# EAGLE design SolarCellY_v2_6milmag (EAGLE 9.3.1)
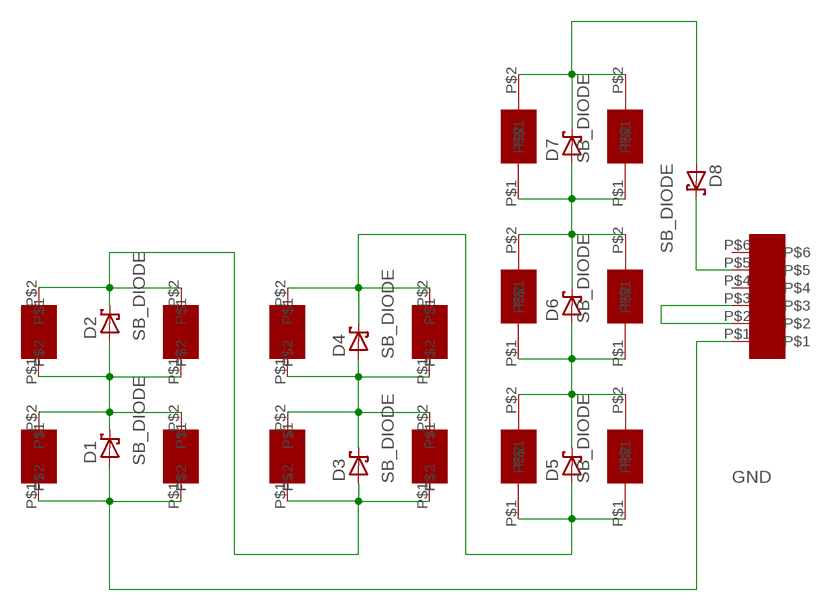
[diagram p0: schematic, sheet 1]

## Parts
11  SLMD121H04L  [SLMD121H04L]
12  SLMD121H04L  [SLMD121H04L]
13  SLMD121H04L  [SLMD121H04L]
14  SLMD121H04L  [SLMD121H04L]
21  SLMD121H04L  [SLMD121H04L]
22  SLMD121H04L  [SLMD121H04L]
23  SLMD121H04L  [SLMD121H04L]
24  SLMD121H04L  [SLMD121H04L]
D1  SB_DIODE  [SB_DIODE]
D2  SB_DIODE  [SB_DIODE]
D3  SB_DIODE  [SB_DIODE]
D4  SB_DIODE  [SB_DIODE]
D5  SB_DIODE  [SB_DIODE]
D6  SB_DIODE  [SB_DIODE]
D7  SB_DIODE  [SB_DIODE]
D8  SB_DIODE  [SB_DIODE]
U$1  M20-8760342  [M20-8760342]
U$2  KXOB22-04X3F  [KXOB22-04X3F]
U$3  KXOB22-04X3F  [KXOB22-04X3F]
U$4  KXOB22-04X3F  [KXOB22-04X3F]
U$5  KXOB22-04X3F  [KXOB22-04X3F]
U$6  KXOB22-04X3F  [KXOB22-04X3F]
U$7  KXOB22-04X3F  [KXOB22-04X3F]

## Nets
GND: 11.P$1 12.P$1 D1.POS U$1.P$1
N$1: U$1.P$2 U$1.P$3
N$2: 11.P$2 12.P$2 13.P$1 14.P$1 D1.NEG D2.POS
N$3: 13.P$2 14.P$2 21.P$1 22.P$1 D2.NEG D3.POS
N$4: 23.P$2 24.P$2 D4.NEG D5.POS U$2.P$1 U$3.P$1
N$5: 21.P$2 22.P$2 23.P$1 24.P$1 D3.NEG D4.POS
N$6: D5.NEG D6.POS U$2.P$2 U$3.P$2 U$4.P$1 U$5.P$1
N$8: D6.NEG D7.POS U$4.P$2 U$5.P$2 U$6.P$1 U$7.P$1
N$10: D7.NEG D8.POS U$6.P$2 U$7.P$2
N$14: D8.NEG U$1.P$5
Unconnected: U$1.P$4 U$1.P$6

## Library data of the parts
11-14 21-24 = Solar:SLMD121H04L; HEIGHT: 2
D1-D8 = Solar:SB_DIODE
U$1 = Solar:M20-8760342; HEIGHT: 8.64
U$2-U$7 = Solar:KXOB22-04X3F; HEIGHT: 1.8

## Net classes
1 power: width 0.254 mm

## Board
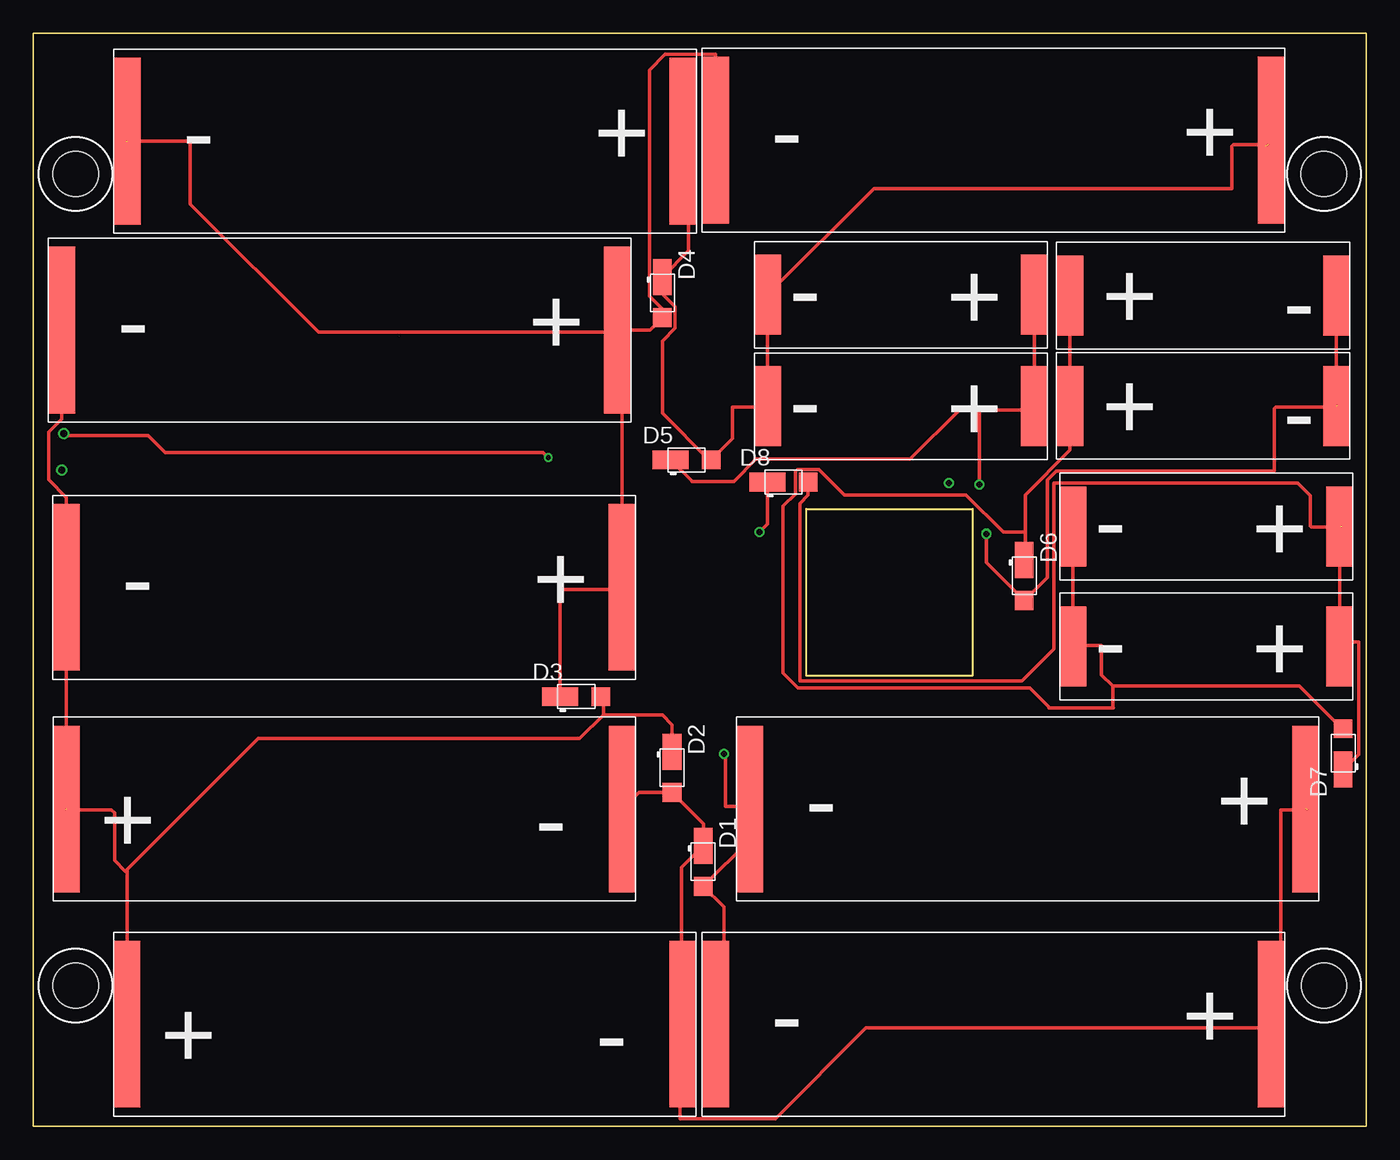
[diagram p1: board, top side]
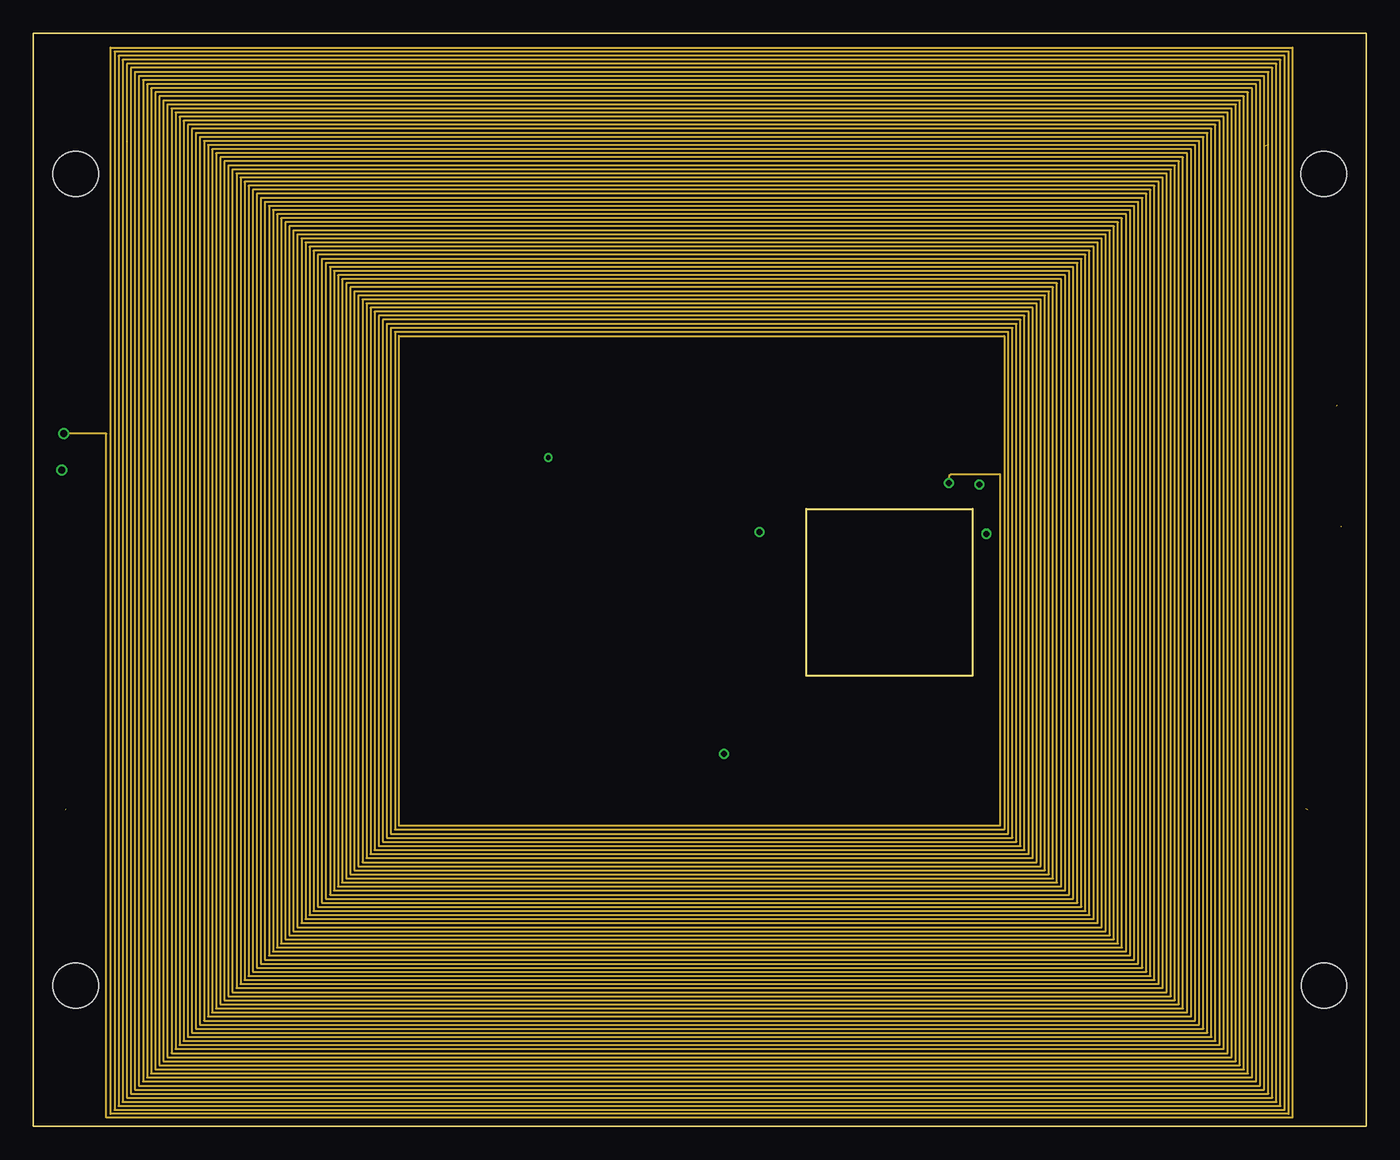
[diagram p2: board, inner layer Route2]
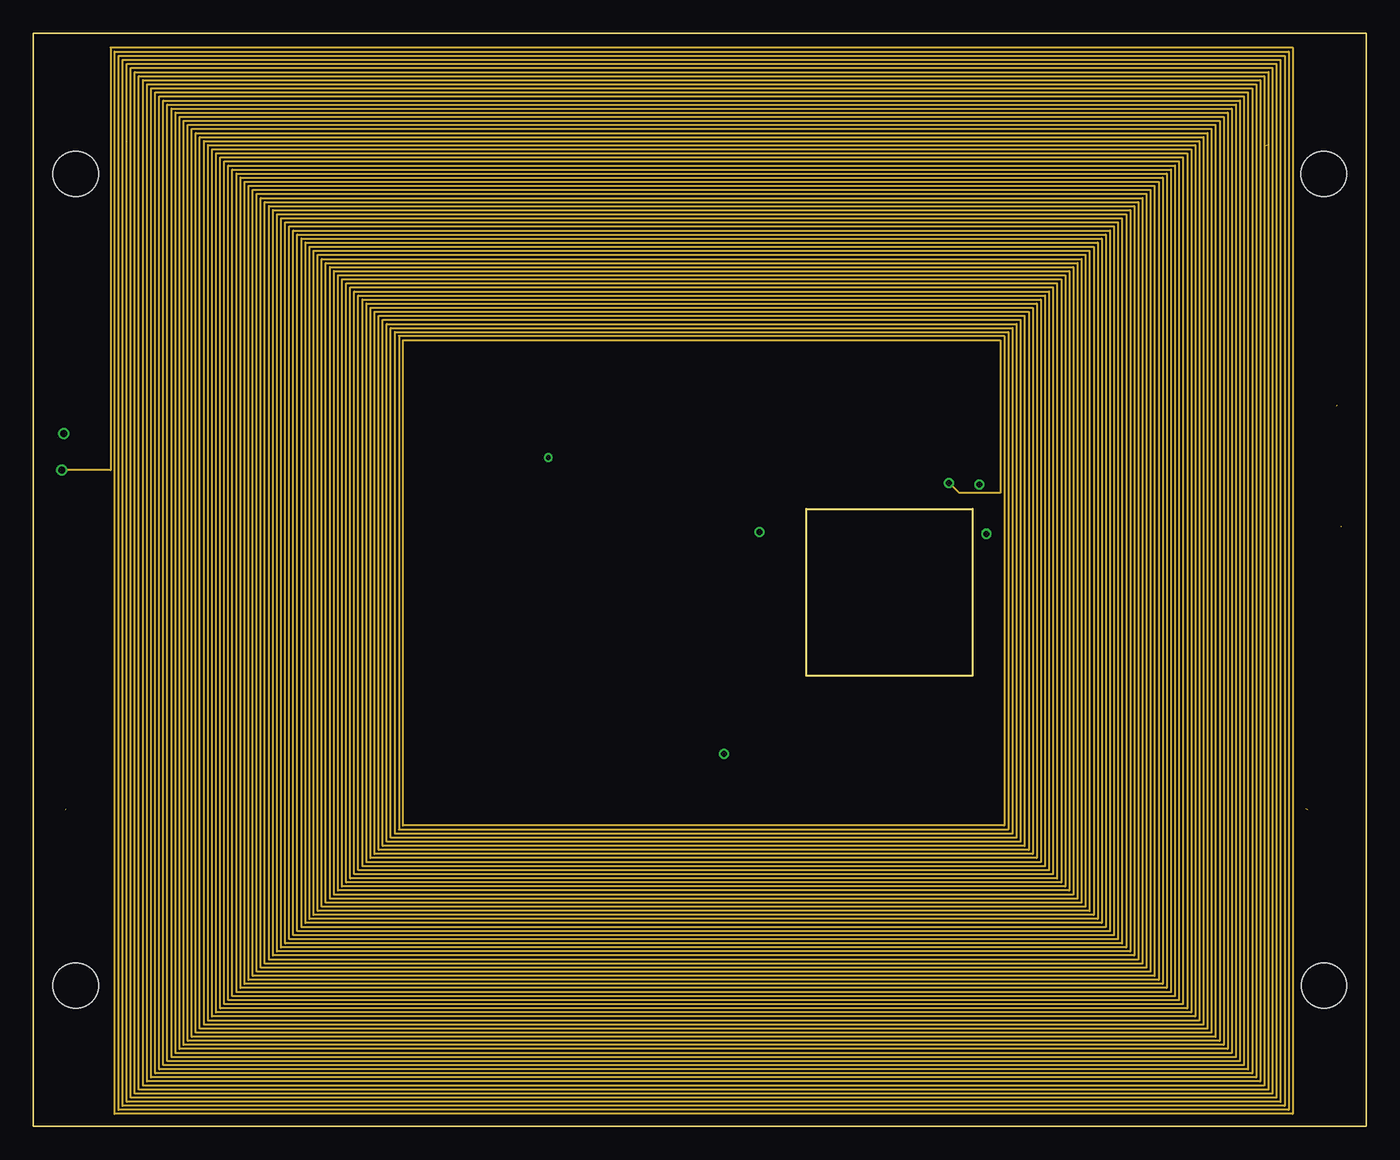
[diagram p3: board, inner layer Route15]
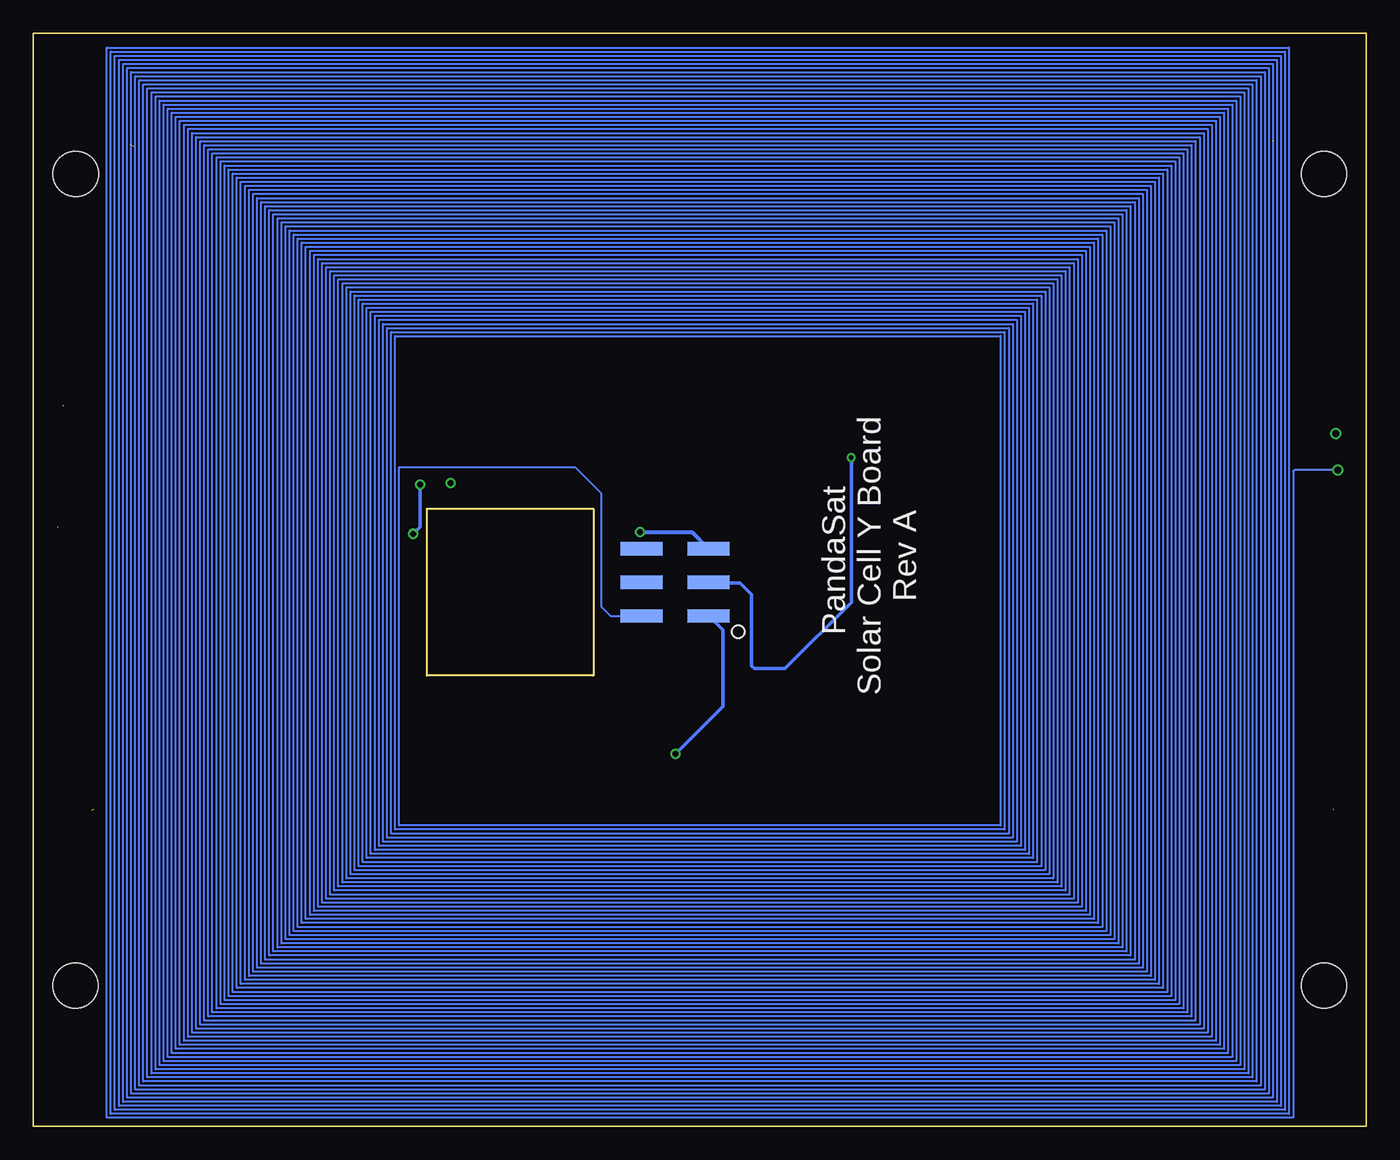
[diagram p4: board, bottom side, seen from below]

Size 100 x 82 mm. Coordinates in mm from the lower left corner, seen from the top.
Outline: 0,0 0,82 100,82 100,0 0,0
Copper layers (1*2*15*16): Top 0.035559375mm / dielectric 0.17018125mm / Route2 0.01778125mm / dielectric 47mil / Route15 0.01778125mm / dielectric 0.17018125mm / Bottom 0.035559375mm
Design rules "oshpark-4layer *": minimum track width 5mil, minimum drill 10mil, track to track 5mil, track to pad 5mil, pad to pad 5mil, via to via 5mil, smd to smd 5mil, copper to edge 15mil, drill to drill 6mil, minimum pad ring 4mil, minimum via ring 6mil, stop-mask expansion 2.5mil, vias tented up to drill 0mil, thermal gap 10mil
Holes 3.4 mm at 3.17,10.55 96.82,71.45 3.17,71.45 96.83,10.55
Milling: 4 lines

### Footprints (pad centres in the part's own frame; a part is rotated, then mirrored left to right if it is on the bottom)
SLMD121H04L = smd 2 x 12.5: P$1 1,6.9; P$2 42.7,6.9
SB_DIODE = smd 2.7 x 1.4: NEG -1.2,0 | smd 1.4 x 1.4: POS 1.85,0
M20-8760342 = smd 1 x 3.15: P$1 0.5,1.575; P$2 0.5,6.625; P$3 3.04,1.575; P$4 3.04,6.625; P$5 5.54,1.575; P$6 5.54,6.625
KXOB22-04X3F = smd 2 x 6: P$1 1,4; P$2 21,4

### Placement (x,y rotation side)
11  50.18,0.76 0 top
12  52.76,16.89 0 top
13  49.73,14.56 180 top
14  45.18,30.7 180 top
21  1.47,33.53 0 top
22  1.14,52.83 0 top
23  6.05,67.01 0 top
24  50.18,67.08 0 top
D1  50.26,19.85 270 top
D2  47.92,26.9 270 top
D3  40.73,32.23 0 top
D4  47.19,62.52 270 top
D5  49,50 0 top
D6  74.35,41.3 270 top
D7  98.27,27.98 90 top
D8  56.28,48.33 0 top
U$1  47.75,37.78 90 bottom
U$2  54.09,58.38 0 top
U$3  54.09,50.02 0 top
U$4  98.77,66.31 180 top
U$5  98.77,58.04 180 top
U$6  77,41 0 top
U$7  77,32 0 top

### Tracks (layer width: path | path; a pad name or v marks a point on that pad's centre or on a via)
GND  (via drill 0.45)
  Top 0.254: 53.76,26 53.76,24.13 | 53.76,24.13 12.P$1 53.76,21.5 D1.POS 51.82,16.44 51.82,8.29 11.P$1 | v51.82,27.94 51.94,27.81 51.94,24 53.63,24 53.76,24.13
  Bottom 0.254: v51.82,27.94 48.26,31.5 48.26,37.22 U$1.P$1
N$1  (via drill 0.35, 0.45, 0.5)  (1 unrouted)
  Top 0.254: v2.29,51.97 2.29,51.94 2.41,51.82 8.64,51.82 9.91,50.55 38.25,50.55 v38.63,50.16
  Route2 0.152: v2.29,51.97 5.49,51.97 5.49,0.65 94.49,0.65 94.49,80.92 5.79,80.92 5.79,0.91 94.18,0.91 94.18,80.62 6.1,80.62 6.1,1.22 93.88,1.22 93.88,80.31 6.4,80.31 6.4,1.52 93.57,1.52 93.57,80.01 6.71,80.01 6.71,1.83 93.27,1.83 93.27,79.7 7.01,79.7 7.01,2.13 92.96,2.13 92.96,79.4 7.32,79.4 7.32,2.44 92.66,2.44 92.66,79.1 7.62,79.1 7.62,2.74 92.35,2.74 92.35,78.79 7.92,78.79 7.92,3.05 92.05,3.05 92.05,78.49 8.23,78.49 8.23,3.35 91.75,3.35 91.75,78.18 8.53,78.18 8.53,3.66 91.44,3.66 91.44,77.88 8.84,77.88 8.84,3.96 91.14,3.96 91.14,77.57 9.14,77.57 9.14,4.27 90.83,4.27 90.83,77.27 9.45,77.27 9.45,4.57 90.53,4.57 90.53,76.96 9.75,76.96 9.75,4.88 90.22,4.88 90.22,76.66 10.06,76.66 10.06,5.18 89.92,5.18 89.92,76.35 10.36,76.35 10.36,5.49 89.61,5.49 89.61,76.05 10.67,76.05 10.67,5.79 89.31,5.79 89.31,75.74 10.97,75.74 10.97,6.1 89,6.1 89,75.44 11.28,75.44 11.28,6.4 88.7,6.4 88.7,75.13 11.58,75.13 11.58,6.71 88.39,6.71 88.39,74.83 11.89,74.83 11.89,7.01 88.09,7.01 88.09,74.52 12.19,74.52 12.19,7.32 87.78,7.32 87.78,74.22 12.5,74.22 12.5,7.62 87.48,7.62 87.48,73.91 12.8,73.91 12.8,7.92 87.17,7.92 87.17,73.61 13.11,73.61 13.11,8.23 86.87,8.23 86.87,73.3 13.41,73.3 13.41,8.53 86.56,8.53 86.56,73 13.72,73 13.72,8.84 86.26,8.84 86.26,72.69 14.02,72.69 14.02,9.14 85.95,9.14 85.95,72.39 14.33,72.39 14.33,9.45 85.65,9.45 85.65,72.08 14.63,72.08 14.63,9.75 85.34,9.75 85.34,71.78 14.94,71.78 14.94,10.06 85.04,10.06 85.04,71.48 15.24,71.48 15.24,10.36 84.73,10.36 84.73,71.17 15.54,71.17 15.54,10.67 84.43,10.67 84.43,70.87 15.85,70.87 15.85,10.97 84.12,10.97 84.12,70.56 16.15,70.56 16.15,11.28 83.82,11.28 83.82,70.26 16.46,70.26 16.46,11.58 83.52,11.58 83.52,69.95 16.76,69.95 16.76,11.89 83.21,11.89 83.21,69.65 17.07,69.65 17.07,12.19 82.91,12.19 82.91,69.34 17.37,69.34 17.37,12.5 82.6,12.5 82.6,69.04 17.68,69.04 17.68,12.8 82.3,12.8 82.3,68.73 17.98,68.73 17.98,13.11 81.99,13.11 81.99,68.43 18.29,68.43 18.29,13.41 81.69,13.41 81.69,68.12 18.59,68.12 18.59,13.72 81.38,13.72 81.38,67.82 18.9,67.82 18.9,14.02 81.08,14.02 81.08,67.51 19.2,67.51 19.2,14.33 80.77,14.33 80.77,67.21 19.51,67.21 19.51,14.63 80.47,14.63 80.47,66.9 19.81,66.9 19.81,14.94 80.16,14.94 80.16,66.6 20.12,66.6 20.12,15.24 79.86,15.24 79.86,66.29 20.42,66.29 20.42,15.54 79.55,15.54 79.55,65.99 20.73,65.99 20.73,15.85 79.25,15.85 79.25,65.68 21.03,65.68 21.03,16.15 78.94,16.15 78.94,65.38 21.34,65.38 21.34,16.46 78.64,16.46 78.64,65.08 21.64,65.08 21.64,16.76 78.33,16.76 78.33,64.77 21.95,64.77 21.95,17.07 78.03,17.07 78.03,64.47 22.25,64.47 22.25,17.37 77.72,17.37 77.72,64.16 22.55,64.16 22.55,17.68 77.42,17.68 77.42,63.86 22.86,63.86 22.86,17.98 77.11,17.98 77.11,63.55 23.16,63.55 23.16,18.29 76.81,18.29 76.81,63.25 23.47,63.25 23.47,18.59 76.5,18.59 76.5,62.94 23.77,62.94 23.77,18.9 76.2,18.9 76.2,62.64 24.08,62.64 24.08,19.2 75.89,19.2 75.89,62.33 24.38,62.33 24.38,19.51 75.59,19.51 75.59,62.03 24.69,62.03 24.69,19.81 75.29,19.81 75.29,61.72 24.99,61.72 24.99,20.12 74.98,20.12 74.98,61.42 25.3,61.42 25.3,20.42 74.68,20.42 74.68,61.11 25.6,61.11 25.6,20.73 74.37,20.73 74.37,60.81 25.91,60.81 25.91,21.03 74.07,21.03 74.07,60.5 26.21,60.5 26.21,21.34 73.76,21.34 73.76,60.2 26.52,60.2 26.52,21.64 73.46,21.64 73.46,59.89 26.82,59.89 26.82,21.95 73.15,21.95 73.15,59.59 27.13,59.59 27.13,22.25 72.85,22.25 72.85,59.28 27.43,59.28 27.43,22.55 72.54,22.55 72.54,48.9 68.83,48.9 68.71,48.77 v68.71,48.26
  Route15 0.152: v2.13,49.23 5.79,49.23 5.79,80.92 94.49,80.92 94.49,0.91 6.1,0.91 6.1,80.62 94.18,80.62 94.18,1.22 6.4,1.22 6.4,80.31 93.88,80.31 93.88,1.52 6.71,1.52 6.71,80.01 93.57,80.01 93.57,1.83 7.01,1.83 7.01,79.7 93.27,79.7 93.27,2.13 7.32,2.13 7.32,79.4 92.96,79.4 92.96,2.44 7.62,2.44 7.62,79.1 92.66,79.1 92.66,2.74 7.92,2.74 7.92,78.79 92.35,78.79 92.35,3.05 8.23,3.05 8.23,78.49 92.05,78.49 92.05,3.35 8.53,3.35 8.53,78.18 91.75,78.18 91.75,3.66 8.84,3.66 8.84,77.88 91.44,77.88 91.44,3.96 9.14,3.96 9.14,77.57 91.14,77.57 91.14,4.27 9.45,4.27 9.45,77.27 90.83,77.27 90.83,4.57 9.75,4.57 9.75,76.96 90.53,76.96 90.53,4.88 10.06,4.88 10.06,76.66 90.22,76.66 90.22,5.18 10.36,5.18 10.36,76.35 89.92,76.35 89.92,5.49 10.67,5.49 10.67,76.05 89.61,76.05 89.61,5.79 10.97,5.79 10.97,75.74 89.31,75.74 89.31,6.1 11.28,6.1 11.28,75.44 89,75.44 89,6.4 11.58,6.4 11.58,75.13 88.7,75.13 88.7,6.71 11.89,6.71 11.89,74.83 88.39,74.83 88.39,7.01 12.19,7.01 12.19,74.52 88.09,74.52 88.09,7.32 12.5,7.32 12.5,74.22 87.78,74.22 87.78,7.62 12.8,7.62 12.8,73.91 87.48,73.91 87.48,7.92 13.11,7.92 13.11,73.61 87.17,73.61 87.17,8.23 13.41,8.23 13.41,73.3 86.87,73.3 86.87,8.53 13.72,8.53 13.72,73 86.56,73 86.56,8.84 14.02,8.84 14.02,72.69 86.26,72.69 86.26,9.14 14.33,9.14 14.33,72.39 85.95,72.39 85.95,9.45 14.63,9.45 14.63,72.08 85.65,72.08 85.65,9.75 14.94,9.75 14.94,71.78 85.34,71.78 85.34,10.06 15.24,10.06 15.24,71.48 85.04,71.48 85.04,10.36 15.54,10.36 15.54,71.17 84.73,71.17 84.73,10.67 15.85,10.67 15.85,70.87 84.43,70.87 84.43,10.97 16.15,10.97 16.15,70.56 84.12,70.56 84.12,11.28 16.46,11.28 16.46,70.26 83.82,70.26 83.82,11.58 16.76,11.58 16.76,69.95 83.52,69.95 83.52,11.89 17.07,11.89 17.07,69.65 83.21,69.65 83.21,12.19 17.37,12.19 17.37,69.34 82.91,69.34 82.91,12.5 17.68,12.5 17.68,69.04 82.6,69.04 82.6,12.8 17.98,12.8 17.98,68.73 82.3,68.73 82.3,13.11 18.29,13.11 18.29,68.43 81.99,68.43 81.99,13.41 18.59,13.41 18.59,68.12 81.69,68.12 81.69,13.72 18.9,13.72 18.9,67.82 81.38,67.82 81.38,14.02 19.2,14.02 19.2,67.51 81.08,67.51 81.08,14.33 19.51,14.33 19.51,67.21 80.77,67.21 80.77,14.63 19.81,14.63 19.81,66.9 80.47,66.9 80.47,14.94 20.12,14.94 20.12,66.6 80.16,66.6 80.16,15.24 20.42,15.24 20.42,66.29 79.86,66.29 79.86,15.54 20.73,15.54 20.73,65.99 79.55,65.99 79.55,15.85 21.03,15.85 21.03,65.68 79.25,65.68 79.25,16.15 21.34,16.15 21.34,65.38 78.94,65.38 78.94,16.46 21.64,16.46 21.64,65.08 78.64,65.08 78.64,16.76 21.95,16.76 21.95,64.77 78.33,64.77 78.33,17.07 22.25,17.07 22.25,64.47 78.03,64.47 78.03,17.37 22.55,17.37 22.55,64.16 77.72,64.16 77.72,17.68 22.86,17.68 22.86,63.86 77.42,63.86 77.42,17.98 23.16,17.98 23.16,63.55 77.11,63.55 77.11,18.29 23.47,18.29 23.47,63.25 76.81,63.25 76.81,18.59 23.77,18.59 23.77,62.94 76.5,62.94 76.5,18.9 24.08,18.9 24.08,62.64 76.2,62.64 76.2,19.2 24.38,19.2 24.38,62.33 75.89,62.33 75.89,19.51 24.69,19.51 24.69,62.03 75.59,62.03 75.59,19.81 24.99,19.81 24.99,61.72 75.29,61.72 75.29,20.12 25.3,20.12 25.3,61.42 74.98,61.42 74.98,20.42 25.6,20.42 25.6,61.11 74.68,61.11 74.68,20.73 25.91,20.73 25.91,60.81 74.37,60.81 74.37,21.03 26.21,21.03 26.21,60.5 74.07,60.5 74.07,21.34 26.52,21.34 26.52,60.2 73.76,60.2 73.76,21.64 26.82,21.64 26.82,59.89 73.46,59.89 73.46,21.95 27.13,21.95 27.13,59.59 73.15,59.59 73.15,22.25 27.43,22.25 27.43,59.28 72.85,59.28 72.85,22.55 27.74,22.55 27.74,58.98 72.54,58.98 72.54,47.52 69.47,47.52 68.71,48.28
  Bottom 0.152: v2.13,49.23 5.41,49.23 5.49,49.15 5.49,0.65 94.49,0.65 94.49,80.92 5.79,80.92 5.79,0.91 94.18,0.91 94.18,80.62 6.1,80.62 6.1,1.22 93.88,1.22 93.88,80.31 6.4,80.31 6.4,1.52 93.57,1.52 93.57,80.01 6.71,80.01 6.71,1.83 93.27,1.83 93.27,79.7 7.01,79.7 7.01,2.13 92.96,2.13 92.96,79.4 7.32,79.4 7.32,2.44 92.66,2.44 92.66,79.1 7.62,79.1 7.62,2.74 92.35,2.74 92.35,78.79 7.92,78.79 7.92,3.05 92.05,3.05 92.05,78.49 8.23,78.49 8.23,3.35 91.75,3.35 91.75,78.18 8.53,78.18 8.53,3.66 91.44,3.66 91.44,77.88 8.84,77.88 8.84,3.96 91.14,3.96 91.14,77.57 9.14,77.57 9.14,4.27 90.83,4.27 90.83,77.27 9.45,77.27 9.45,4.57 90.53,4.57 90.53,76.96 9.75,76.96 9.75,4.88 90.22,4.88 90.22,76.66 10.06,76.66 10.06,5.18 89.92,5.18 89.92,76.35 10.36,76.35 10.36,5.49 89.61,5.49 89.61,76.05 10.67,76.05 10.67,5.79 89.31,5.79 89.31,75.74 10.97,75.74 10.97,6.1 89,6.1 89,75.44 11.28,75.44 11.28,6.4 88.7,6.4 88.7,75.13 11.58,75.13 11.58,6.71 88.39,6.71 88.39,74.83 11.89,74.83 11.89,7.01 88.09,7.01 88.09,74.52 12.19,74.52 12.19,7.32 87.78,7.32 87.78,74.22 12.5,74.22 12.5,7.62 87.48,7.62 87.48,73.91 12.8,73.91 12.8,7.92 87.17,7.92 87.17,73.61 13.11,73.61 13.11,8.23 86.87,8.23 86.87,73.3 13.41,73.3 13.41,8.53 86.56,8.53 86.56,73 13.72,73 13.72,8.84 86.26,8.84 86.26,72.69 14.02,72.69 14.02,9.14 85.95,9.14 85.95,72.39 14.33,72.39 14.33,9.45 85.65,9.45 85.65,72.08 14.63,72.08 14.63,9.75 85.34,9.75 85.34,71.78 14.94,71.78 14.94,10.06 85.04,10.06 85.04,71.48 15.24,71.48 15.24,10.36 84.73,10.36 84.73,71.17 15.54,71.17 15.54,10.67 84.43,10.67 84.43,70.87 15.85,70.87 15.85,10.97 84.12,10.97 84.12,70.56 16.15,70.56 16.15,11.28 83.82,11.28 83.82,70.26 16.46,70.26 16.46,11.58 83.52,11.58 83.52,69.95 16.76,69.95 16.76,11.89 83.21,11.89 83.21,69.65 17.07,69.65 17.07,12.19 82.91,12.19 82.91,69.34 17.37,69.34 17.37,12.5 82.6,12.5 82.6,69.04 17.68,69.04 17.68,12.8 82.3,12.8 82.3,68.73 17.98,68.73 17.98,13.11 81.99,13.11 81.99,68.43 18.29,68.43 18.29,13.41 81.69,13.41 81.69,68.12 18.59,68.12 18.59,13.72 81.38,13.72 81.38,67.82 18.9,67.82 18.9,14.02 81.08,14.02 81.08,67.51 19.2,67.51 19.2,14.33 80.77,14.33 80.77,67.21 19.51,67.21 19.51,14.63 80.47,14.63 80.47,66.9 19.81,66.9 19.81,14.94 80.16,14.94 80.16,66.6 20.12,66.6 20.12,15.24 79.86,15.24 79.86,66.29 20.42,66.29 20.42,15.54 79.55,15.54 79.55,65.99 20.73,65.99 20.73,15.85 79.25,15.85 79.25,65.68 21.03,65.68 21.03,16.15 78.94,16.15 78.94,65.38 21.34,65.38 21.34,16.46 78.64,16.46 78.64,65.08 21.64,65.08 21.64,16.76 78.33,16.76 78.33,64.77 21.95,64.77 21.95,17.07 78.03,17.07 78.03,64.47 22.25,64.47 22.25,17.37 77.72,17.37 77.72,64.16 22.55,64.16 22.55,17.68 77.42,17.68 77.42,63.86 22.86,63.86 22.86,17.98 77.11,17.98 77.11,63.55 23.16,63.55 23.16,18.29 76.81,18.29 76.81,63.25 23.47,63.25 23.47,18.59 76.5,18.59 76.5,62.94 23.77,62.94 23.77,18.9 76.2,18.9 76.2,62.64 24.08,62.64 24.08,19.2 75.89,19.2 75.89,62.33 24.38,62.33 24.38,19.51 75.59,19.51 75.59,62.03 24.69,62.03 24.69,19.81 75.29,19.81 75.29,61.72 24.99,61.72 24.99,20.12 74.98,20.12 74.98,61.42 25.3,61.42 25.3,20.42 74.68,20.42 74.68,61.11 25.6,61.11 25.6,20.73 74.37,20.73 74.37,60.81 25.91,60.81 25.91,21.03 74.07,21.03 74.07,60.5 26.21,60.5 26.21,21.34 73.76,21.34 73.76,60.2 26.52,60.2 26.52,21.64 73.46,21.64 73.46,59.89 26.82,59.89 26.82,21.95 73.15,21.95 73.15,59.59 27.13,59.59 27.13,22.25 72.85,22.25 72.85,59.28 27.43,59.28 27.43,22.55 72.54,22.55 72.54,49.45 59.36,49.45 57.4,47.5 57.4,38.99 56.7,38.28 U$1.P$2
  Bottom 0.254: 49.27,40.77 46.99,40.77 46.1,39.88 46.1,34.54 45.88,34.33 43.62,34.33 38.63,39.31 v38.63,50.16
  Bottom 0.305: 49.27,40.77 U$1.P$3
N$2  (1 unrouted)
  Top 0.254: 14.P$1 45.44,25.05 D2.POS 50.29,22.68 50.29,21.08 D1.NEG 48.64,19.43 48.64,7.75 13.P$1 48.51,7.44 48.51,0.57 55.69,0.57 62.48,7.37 92.59,7.37 11.P$2 93.6,8.38 93.6,23.75 95.63,23.75
N$3  (1 unrouted)
  Top 0.254: 13.P$2 7.03,19.26 | 7.03,19.26 6.91,19.13 6.1,19.94 6.1,23.5 5.84,23.75 2.41,23.75 | 7.03,19.26 16.86,29.08 41,29.08 42.79,30.87 42.8,30.86 | 42.8,30.86 47.19,30.86 47.93,30.12 D2.NEG | 2.49,23.8 14.P$2 2.48,40.42 21.P$1 2.47,47.19 1.14,48.51 1.14,52.07 2.13,53.06 22.P$1 | 42.8,30.86 42.8,32.02 D3.POS
N$4  (1 unrouted)
  Top 0.254: D5.POS 50.71,50 47.19,53.52 47.19,58.91 48.14,59.87 48.14,61.48 47.19,62.43 D4.NEG 49.15,65.68 49.15,73.51 23.P$2 | D5.POS 51.08,50 | 55.09,56.77 U$2.P$1 63.07,70.36 89.92,70.36 89.92,73.53 90.04,73.66 92.71,73.66 | 55.09,56.77 U$3.P$1 | 92.42,72.86 92.42,73.52 24.P$2 | D5.POS 52.45,51.6 52.45,53.98 55.12,53.98 55.12,56.74 55.09,56.77
N$5  (1 unrouted)
  Top 0.254: 44.17,39.98 44.17,40.26 | 44.17,40.26 21.P$2 44.17,59.4 22.P$2 | 22.P$2 43.67,59.56 21.4,59.56 11.78,69.18 11.78,73.88 11.81,73.91 6.99,73.91 | 22.P$2 46.27,59.73 47.19,60.65 D4.POS 47.19,61.31 46.24,62.27 46.24,79.25 47.4,80.42 51.18,80.42 24.P$1 | 39.53,40.35 39.5,40.39 | 39.53,40.35 39.62,40.26 44.17,40.26 | D3.NEG 39.53,40.35
N$6  (via drill 0.45)  (1 unrouted)
  Top 0.254: D5.NEG 49.4,48.4 49.4,48.39 52.58,48.39 54.23,50.04 65.79,50.04 69.47,53.72 70.99,53.72 | 74.8,53.72 75.06,53.72 | 70.99,53.72 74.8,53.72 | 74.8,53.72 U$3.P$2 U$2.P$2 | v71.5,44.45 71.5,42.29 D6.POS 76.07,41.17 76.07,48.48 76.74,49.15 93.09,49.15 93.09,53.85 93.22,53.98 97.66,53.98 97.79,54.1 | 97.77,53.82 U$5.P$1 U$4.P$1 | v70.99,48.13 70.99,53.72
  Bottom 0.254: v71.5,44.45 70.99,44.96 v70.99,48.13
N$8
  Top 0.254: 74.42,44.58 74.42,47.37 77.77,50.71 U$5.P$2 U$4.P$2 | 80.98,33.02 95,33.02 98.19,29.83 D7.POS | 74.42,44.58 72.77,44.58 69.98,47.37 60.86,47.37 58.94,49.29 57.33,49.29 57.18,49.14 57.18,47.43 56.26,46.51 56.26,34.01 57.37,32.89 74.77,32.89 76.2,31.46 76.2,31.37 81.03,31.37 80.98,31.41 80.98,33.02 | 74.42,44.58 74.42,42.57 D6.NEG | U$6.P$1 U$7.P$1 78.07,36.07 80.14,36.07 80.14,33.86 80.98,33.02
N$10  (1 unrouted)
  Top 0.254: D8.POS 58.13,47.34 57.53,46.74 57.53,33.4 74.17,33.4 76.58,35.81 76.58,48.26 94.87,48.26 95.82,47.31 95.82,45.02 95.89,44.96 98.17,44.96 | D7.NEG 98.31,26.78 99.43,27.9 99.43,36.32 98,36.32 | 98,36.32 U$6.P$2 98.13,45 | 98,36.32 U$7.P$2
N$14  (via drill 0.45)
  Top 0.254: D8.NEG 55.09,45.18 v54.48,44.58
  Bottom 0.305: v54.48,44.58 50.58,44.58 U$1.P$5

### Text on the board
bPlace: PandaSat / Solar Cell Y Board / Rev A